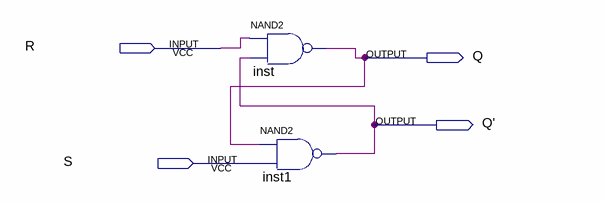
[diagram p0: schematic sheet]
// Quartus schematic nand.bdf as structural Verilog: 2 symbols, 4 pins
module \nand  (
  input  R,
  input  S,
  output Q,
  output \Q' 
);

  nand inst (Q, R, \Q' );
  nand inst1 (\Q' , Q, S);
endmodule
